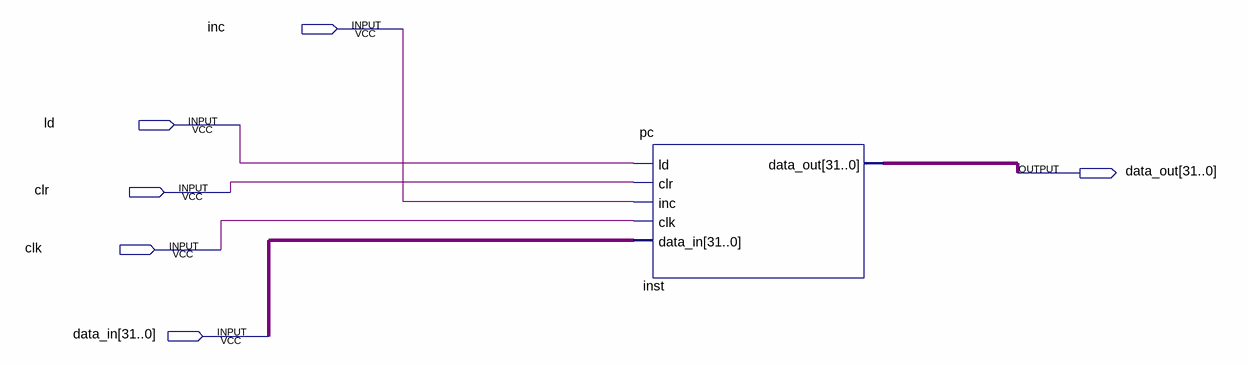
[diagram p0: schematic sheet]
// Quartus schematic testbench.bdf as structural Verilog: 1 symbols, 6 pins
module testbench (
  input  inc,
  input  ld,
  input  clr,
  input  clk,
  input  [31:0] data_in,
  output [31:0] data_out
);

  pc inst (.ld(ld), .clr(clr), .inc(inc), .clk(clk), .data_in(data_in), .data_out(data_out));
endmodule
